# Altium schematic sheet ELVIS.SchDoc
size A4
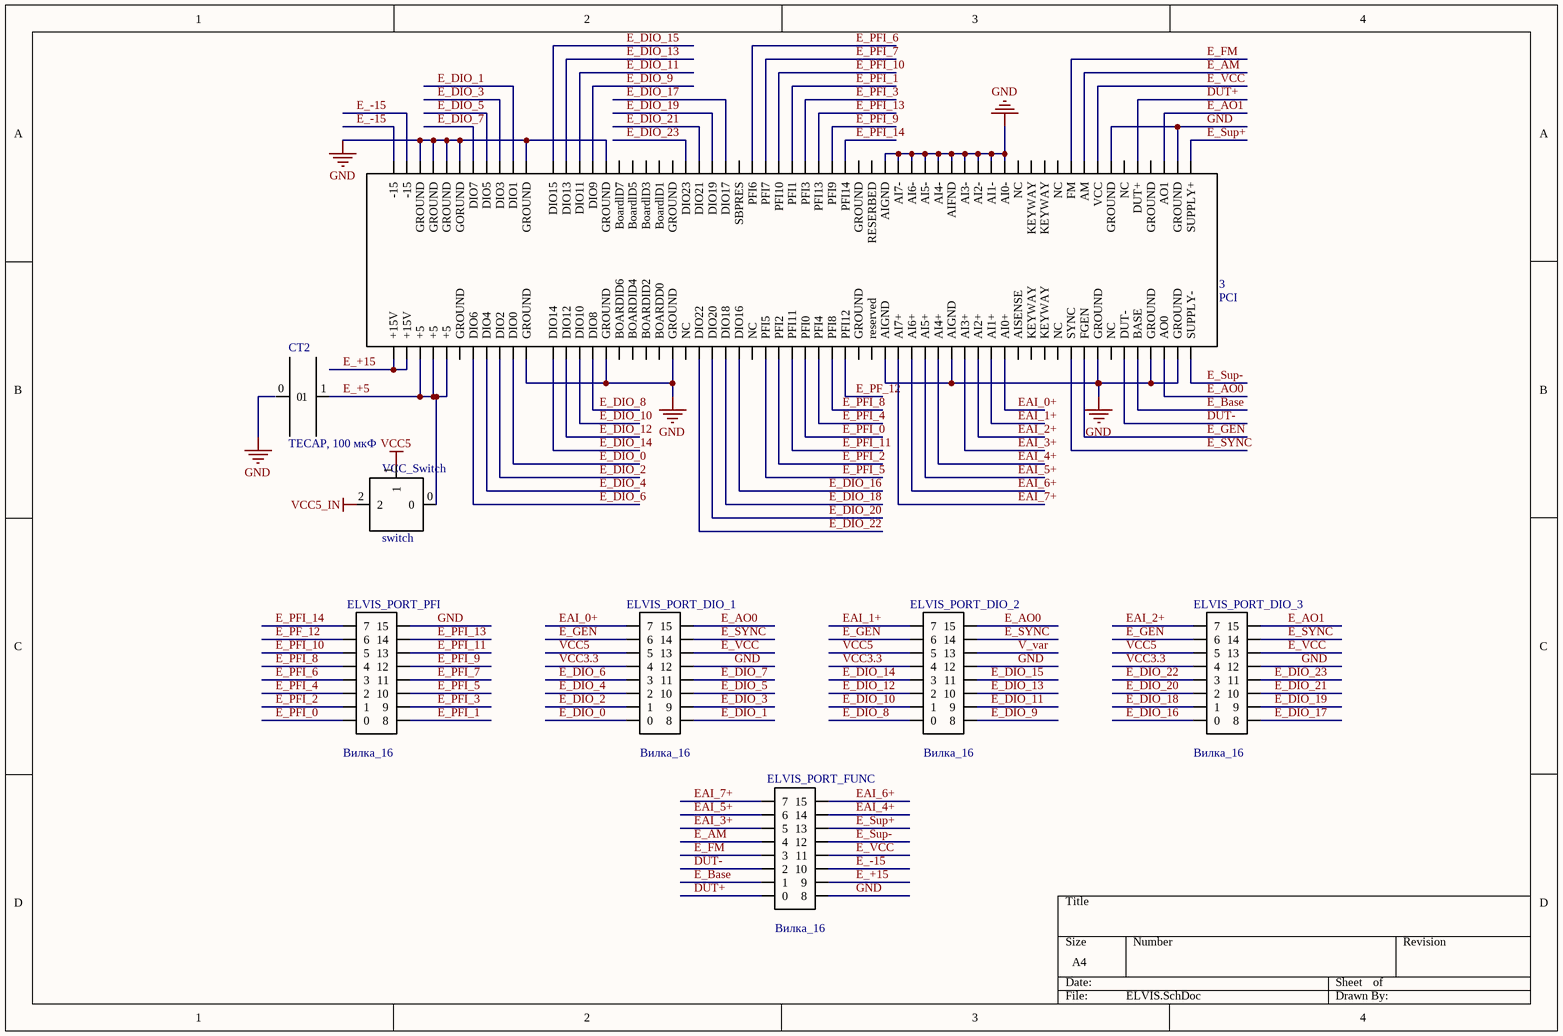
[diagram p0: ELVIS.SchDoc]

## Parts
3  PCI  [PCI-120]
CT2  TECAP, 100 мкФ  [tantal cap]
ELVIS_PORT_DIO_1  Вилка_16  [DS1013-16]
ELVIS_PORT_DIO_2  Вилка_16  [DS1013-16]
ELVIS_PORT_DIO_3  Вилка_16  [DS1013-16]
ELVIS_PORT_FUNC  Вилка_16  [DS1013-16]
ELVIS_PORT_PFI  Вилка_16  [DS1013-16]
VCC_Switch  switch  [К(Р)142ЕН5В]

## Nets
GND: 3.10(GROUND) 3.15(GROUND) 3.20(GROUND) 3.36(AIGND) 3.41(AIGND) 3.51(GROUND) 3.55(GROUND) 3.57(GROUND) 3.60(GROUND) 3.65(GROUND) 3.72(AI0-) 3.73(AI1-) 3.74(AI2-) 3.75(AI3-) 3.76(AIFND) 3.77(AI4-) 3.78(AI5-) 3.79(AI6-) 3.80(AI7-) 3.81(AIGND) 3.102(GROUND) 3.107(GROUND) 3.112(GORUND) 3.113(GROUND) 3.114(GROUND) 3.115(GROUND) ELVIS_PORT_DIO_1.12 ELVIS_PORT_DIO_2.12 ELVIS_PORT_DIO_3.12 ELVIS_PORT_FUNC.8 ELVIS_PORT_PFI.15
VCC5: ELVIS_PORT_DIO_1.5 ELVIS_PORT_DIO_2.5 ELVIS_PORT_DIO_3.5 VCC_Switch.1
VCC5_IN: VCC_Switch.2
DUT+: 3.63(DUT+) ELVIS_PORT_FUNC.0
DUT-: 3.53(DUT-) ELVIS_PORT_FUNC.2
E_+5: 3.2(+5) 3.3(+5) 3.4(+5) CT2.1 VCC_Switch.0
E_+15: 3.0(+15V) 3.1(+15V) ELVIS_PORT_FUNC.9
E_-15: 3.116(-15) 3.117(-15) ELVIS_PORT_FUNC.10
E_AM: 3.67(AM) ELVIS_PORT_FUNC.4
E_AO0: 3.56(AO0) ELVIS_PORT_DIO_1.15 ELVIS_PORT_DIO_2.15
E_AO1: 3.61(AO1) ELVIS_PORT_DIO_3.15
E_Base: 3.54(BASE) ELVIS_PORT_FUNC.1
E_DIO_0: 3.9(DIO0) ELVIS_PORT_DIO_1.0
E_DIO_1: 3.108(DIO1) ELVIS_PORT_DIO_1.8
E_DIO_2: 3.8(DIO2) ELVIS_PORT_DIO_1.1
E_DIO_3: 3.109(DIO3) ELVIS_PORT_DIO_1.9
E_DIO_4: 3.7(DIO4) ELVIS_PORT_DIO_1.2
E_DIO_5: 3.110(DIO5) ELVIS_PORT_DIO_1.10
E_DIO_6: 3.6(DIO6) ELVIS_PORT_DIO_1.3
E_DIO_7: 3.111(DIO7) ELVIS_PORT_DIO_1.11
E_DIO_8: 3.14(DIO8) ELVIS_PORT_DIO_2.0
E_DIO_9: 3.103(DIO9) ELVIS_PORT_DIO_2.8
E_DIO_10: 3.13(DIO10) ELVIS_PORT_DIO_2.1
E_DIO_11: 3.104(DIO11) ELVIS_PORT_DIO_2.9
E_DIO_12: 3.12(DIO12) ELVIS_PORT_DIO_2.2
E_DIO_13: 3.105(DIO13) ELVIS_PORT_DIO_2.10
E_DIO_14: 3.11(DIO14) ELVIS_PORT_DIO_2.3
E_DIO_15: 3.106(DIO15) ELVIS_PORT_DIO_2.11
E_DIO_16: 3.25(DIO16) ELVIS_PORT_DIO_3.0
E_DIO_17: 3.93(DIO17) ELVIS_PORT_DIO_3.8
E_DIO_18: 3.24(DIO18) ELVIS_PORT_DIO_3.1
E_DIO_19: 3.94(DIO19) ELVIS_PORT_DIO_3.9
E_DIO_20: 3.23(DIO20) ELVIS_PORT_DIO_3.2
E_DIO_21: 3.95(DIO21) ELVIS_PORT_DIO_3.10
E_DIO_22: 3.22(DIO22) ELVIS_PORT_DIO_3.3
E_DIO_23: 3.96(DIO23) ELVIS_PORT_DIO_3.11
E_FM: 3.68(FM) ELVIS_PORT_FUNC.3
E_GEN: 3.50(FGEN) ELVIS_PORT_DIO_1.6 ELVIS_PORT_DIO_2.6 ELVIS_PORT_DIO_3.6
E_PF_12: 3.33(PFI12) ELVIS_PORT_PFI.6
E_PFI_0: 3.30(PFI0) ELVIS_PORT_PFI.0
E_PFI_1: 3.88(PFI1) ELVIS_PORT_PFI.8
E_PFI_2: 3.28(PFI2) ELVIS_PORT_PFI.1
E_PFI_3: 3.87(PFI3) ELVIS_PORT_PFI.9
E_PFI_4: 3.31(PFI4) ELVIS_PORT_PFI.2
E_PFI_5: 3.27(PFI5) ELVIS_PORT_PFI.10
E_PFI_6: 3.91(PFI6) ELVIS_PORT_PFI.3
E_PFI_7: 3.90(PFI7) ELVIS_PORT_PFI.11
E_PFI_8: 3.32(PFI8) ELVIS_PORT_PFI.4
E_PFI_9: 3.85(PFI9) ELVIS_PORT_PFI.12
E_PFI_10: 3.89(PFI10) ELVIS_PORT_PFI.5
E_PFI_11: 3.29(PFI11) ELVIS_PORT_PFI.13
E_PFI_13: 3.86(PFI13) ELVIS_PORT_PFI.14
E_PFI_14: 3.84(PFI14) ELVIS_PORT_PFI.7
E_Sup+: 3.59(SUPPLY+) ELVIS_PORT_FUNC.13
E_Sup-: 3.58(SUPPLY-) ELVIS_PORT_FUNC.12
E_SYNC: 3.49(SYNC) ELVIS_PORT_DIO_1.14 ELVIS_PORT_DIO_2.14 ELVIS_PORT_DIO_3.14
E_VCC: 3.66(VCC) ELVIS_PORT_DIO_1.13 ELVIS_PORT_DIO_3.13 ELVIS_PORT_FUNC.11
EAI_0+: 3.45(AI0+) ELVIS_PORT_DIO_1.7
EAI_1+: 3.44(AI1+) ELVIS_PORT_DIO_2.7
EAI_2+: 3.43(AI2+) ELVIS_PORT_DIO_3.7
EAI_3+: 3.42(AI3+) ELVIS_PORT_FUNC.5
EAI_4+: 3.40(AI4+) ELVIS_PORT_FUNC.14
EAI_5+: 3.39(AI5+) ELVIS_PORT_FUNC.6
EAI_6+: 3.38(AI6+) ELVIS_PORT_FUNC.15
EAI_7+: 3.37(AI7+) ELVIS_PORT_FUNC.7
V_var: ELVIS_PORT_DIO_2.13
VCC3.3: ELVIS_PORT_DIO_1.4 ELVIS_PORT_DIO_2.4 ELVIS_PORT_DIO_3.4

Not connected (* = marked no-connect by the designer): 3 5(GROUND) 16(BOARDID6) 17(BOARDID4) 18(BOARDID2) 19(BOARDD0) 21(NC) 26(NC) 34(GROUND) 35(reserved) 46(AISENSE) 47(KEYWAY) 48(NC) 52(NC) 62(GROUND) 64(NC) 69(NC) 70(KEYWAY) 71(NC) 82(RESERBED) 83(GROUND) 92(SBPRES) 97(GROUND) 98(BoardlD1) 99(BoardlD3) 100(BoardlD5) 101(BoardlD7) 118(KEYWAY) 119(KEYWAY); CT2 0

## Library data of the parts
ELVIS_PORT_DIO_1-ELVIS_PORT_DIO_3 ELVIS_PORT_FUNC ELVIS_PORT_PFI = DS1013-16: 16_pin